# Altium schematic sheet Schematic.SchDoc
size A4; SheetNumber: 1; SheetTotal: 1
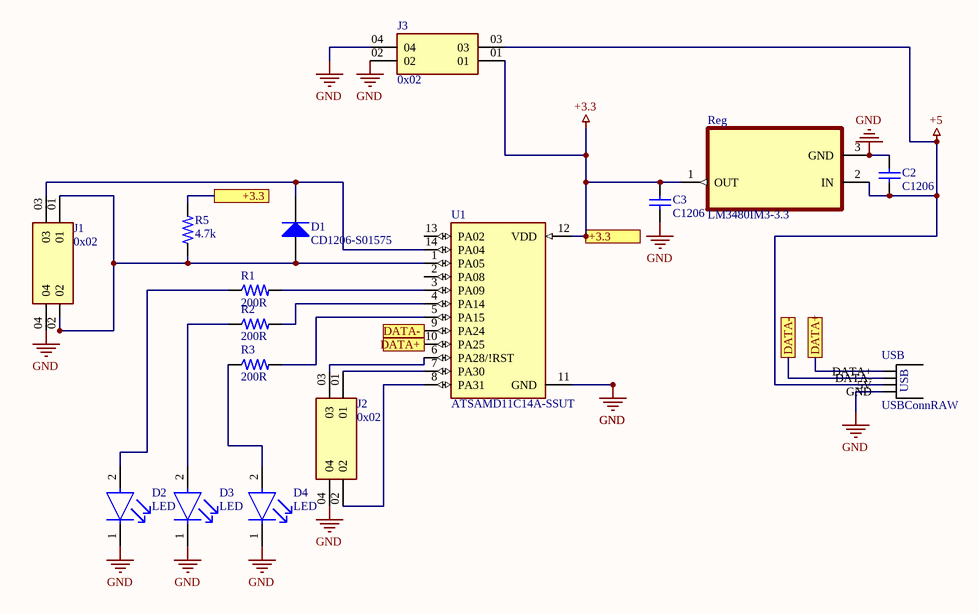
[diagram p0: Schematic.SchDoc]

## Parts
C2  C1206  [KEMT-1206-2_M]
C3  C1206  [KEMT-1206-2_M]
D1  CD1206-S01575  [BOUR-CD1206-S01575-2_L]
D2  LED  [FP-APTD3216CGCK-MFG]
D3  LED  [FP-APTD3216CGCK-MFG]
D4  LED  [FP-APTD3216CGCK-MFG]
J1  0x02  [SAMTEC_TSM-102-02-T-DV]
J2  0x02  [SAMTEC_TSM-102-02-T-DV]
J3  0x02  [SAMTEC_TSM-102-02-T-DV]
R1  200R  [RESC3115X65N]
R2  200R  [RESC3115X65N]
R3  200R  [RESC3115X65N]
R5  4.7k  [RESC3115X65N]
Reg  LM3480IM3-3.3  [SOT95P251X112-3N]
U1  ATSAMD11C14A-SSUT  [SOIC127P600X160-14N]
USB  USBConnRAW  [USBConnRAW]

## Ports
+3.3, DATA+, DATA-

## Nets
+3.3: C3.2 J3.01 R5.1 Reg.1(OUT) U1.12(VDD) ; port +3.3
+5: C2.2 J3.03 Reg.2(IN) USB.5V
GND: C2.1 C3.1 D2.1(C) D3.1(C) D4.1(C) J1.04 J2.04 J3.02 J3.04 Reg.3(GND) U1.11(GND) USB.GND
DATA+: U1.10(PA25) USB.DATA+ ; port DATA+
DATA-: U1.9(PA24) USB.DATA- ; port DATA-
NetD1_1: D1.1(A) J1.01 J1.02 R5.2 U1.1(PA05)
NetD1_2: D1.2(K) J1.03 U1.14(PA04)
NetD2_2: D2.2(A) R1.1
NetD3_2: D3.2(A) R2.1
NetD4_2: D4.2(A) R3.1
NetJ2_01: J2.01 U1.7(PA30)
NetJ2_02: J2.02 U1.8(PA31)
NetJ2_03: J2.03 U1.6(PA28/!RST)
NetR1_2: R1.2 U1.3(PA09)
NetR2_2: R2.2 U1.4(PA14)
NetR3_2: R3.2 U1.5(PA15)

Not connected (* = marked no-connect by the designer): U1 2(PA08) 13(PA02)

## Library data of the parts
C2 C3 = CMP-1037-04202-2: CAP, Ceramic, 0.1 uF, +/- 10%, 50 V, -55 to 125 degC, 1206 (3216 Metric), RoHS, Tape and Reel; Manufacturer: Kemet; Voltage Rating: 50V; Capacitance: 0.1µF; Product Range: KEMET-CSeries; SVHC: ToBeAdvised; Dielectric Characteristic: X7R; Capacitor Case Style: 1206[3216Metric]; Package Reference: 1206-2; Package Description: 2-Leads SMD, Body 3.2 x 1.6 mm; Packaging: Tape&Reel; Operating Temperature Max: 125degC; Capacitance Tolerance: ±10%; Datasheet URL: https://datasheet.ciiva.com/6125/1725438-6125494.pdf; Manufacturer URL: http://www.kemet.com/; Operating Temperature Min: -55degC; Datasheet Version: Jul-13
D1 = CMP-0583-00001-2: 75 V Small Signal Switching Diode, 150 mA, 2.5 uA, 1026 Molded Package, RoHS, Tape and Reel; Manufacturer: Bourns; Reverse Voltage: 75 V; Average Forward Current: 150 mA; Reverse Current (Max.): 2.5 uA; Capacitance Between Terminals (Max.): 3 pF; Reverse Recovery Time (Max.): 4 nS; Forward Voltage (Max.): 1.00 V; Packing: Tape and Reel; Mounting Technology: Surface Mount; DatasheetVersion: Rev. 06/11; ComponentLink2URL: http://www.bourns.com/data/global/pdfs/CD1206_S01575.pdf; PackageReference: CD1206-S01575-2; RoHS: TRUE; ComponentLink1URL: http://www.bourns.com/; ComponentLink1Description: Manufacturer URL; ComponentLink3Description: Package Specification; ComponentLink3URL: http://www.bourns.com/data/global/pdfs/CD1206_S01575.pdf; ComponentLink2Description: Datasheet; PackageDescription: 2-Pin SMD, Body 3.2 x 1.5 mm; PartNumber: CD1206-S01575
D2-D4 = CMP-2000-05792-2: LED GREEN CLEAR 2SMD; Forward Voltage: 2.1V; Forward Current: 20mA; Luminous Intensity: 300mcd; Number of LEDs: 1; Dominant Wavelength: 570nm; Viewing Angle: 50°; Lead Free: Lead Free; Lens Color: Clear; Mount: Surface Mount; Package Quantity: 2000; Height: 1.8mm; Number of Pins: 2; Test Current: 20mA; Case Code (Metric): 3216; Case/Package: 1206; Case Code (Imperial): 1206; Illumination Color: Green; Color: Green; Width: 1.6mm; Packaging: Tape and Reel; Min Operating Temperature: -40°C; Lens Style: Clear; Max Operating Temperature: 85°C; Length: 3.2mm
J1-J3 = TSM-102-02-T-DV: TSM - Samtec 2.54mm Dual Row Vertical Surface Mount Header 8.13mm Post Height (02) - Fast Stock; MF: Samtec Inc.; MP: TSM-102-02-T-DV; Value: *; Purchase-URL: https://pricing.snapeda.com/search/part/TSM-102-02-T-DV/?ref=eda; SnapEDA_Link: https://www.snapeda.com/parts/TSM-102-02-T-DV/Samtec%20Inc./view-part/3473333/?ref=snap; Price: None; Package: None; Check_prices: https://www.snapeda.com/parts/TSM-102-02-T-DV/Samtec%20Inc./view-part/3473333/?ref=eda; Availability: Warning
R1-R3 R5 = 4-2176245-2: CRGS1206 5% 2K7; Package: None; Price: None; Value: *; MP: 4-2176245-2; Availability: Unavailable
Reg = LM3480IM3-3.3: 100-mA, 30-V, low-dropout voltage regulator 3-SOT-23 -40 to 125; MP: LM3480IM3-3.3/NOPB; MF: Texas; Check_prices: https://www.snapeda.com/parts/LM3480IM3-3.3/NOPB/Texas%20Instruments/view-part/15344/?ref=eda; Price: None; SnapEDA_Link: https://www.snapeda.com/parts/LM3480IM3-3.3/NOPB/Texas%20Instruments/view-part/15344/?ref=snap; Availability: Good; Value: *; Purchase-URL: https://pricing.snapeda.com/search/part/LM3480IM3-3.3/NOPB/?ref=eda; Package: SOT-23 Texas
U1 = ATSAMD11C14A-SSUT: MCU 32-Bit SAM D11 ARM Cortex M0+ RISC 16KB Flash 1.8V/2.5V/3.3V 14-Pin SOIC T/R; Package: None; Price: None; Value: *; MP: ATSAMD11C14A-SSUT; Availability: Unavailable
USB = USBConnRAW: USB Connector directly on the PCB, without connector